# EAGLE design c64_csadapter-v1.0c (EAGLE 4.15)
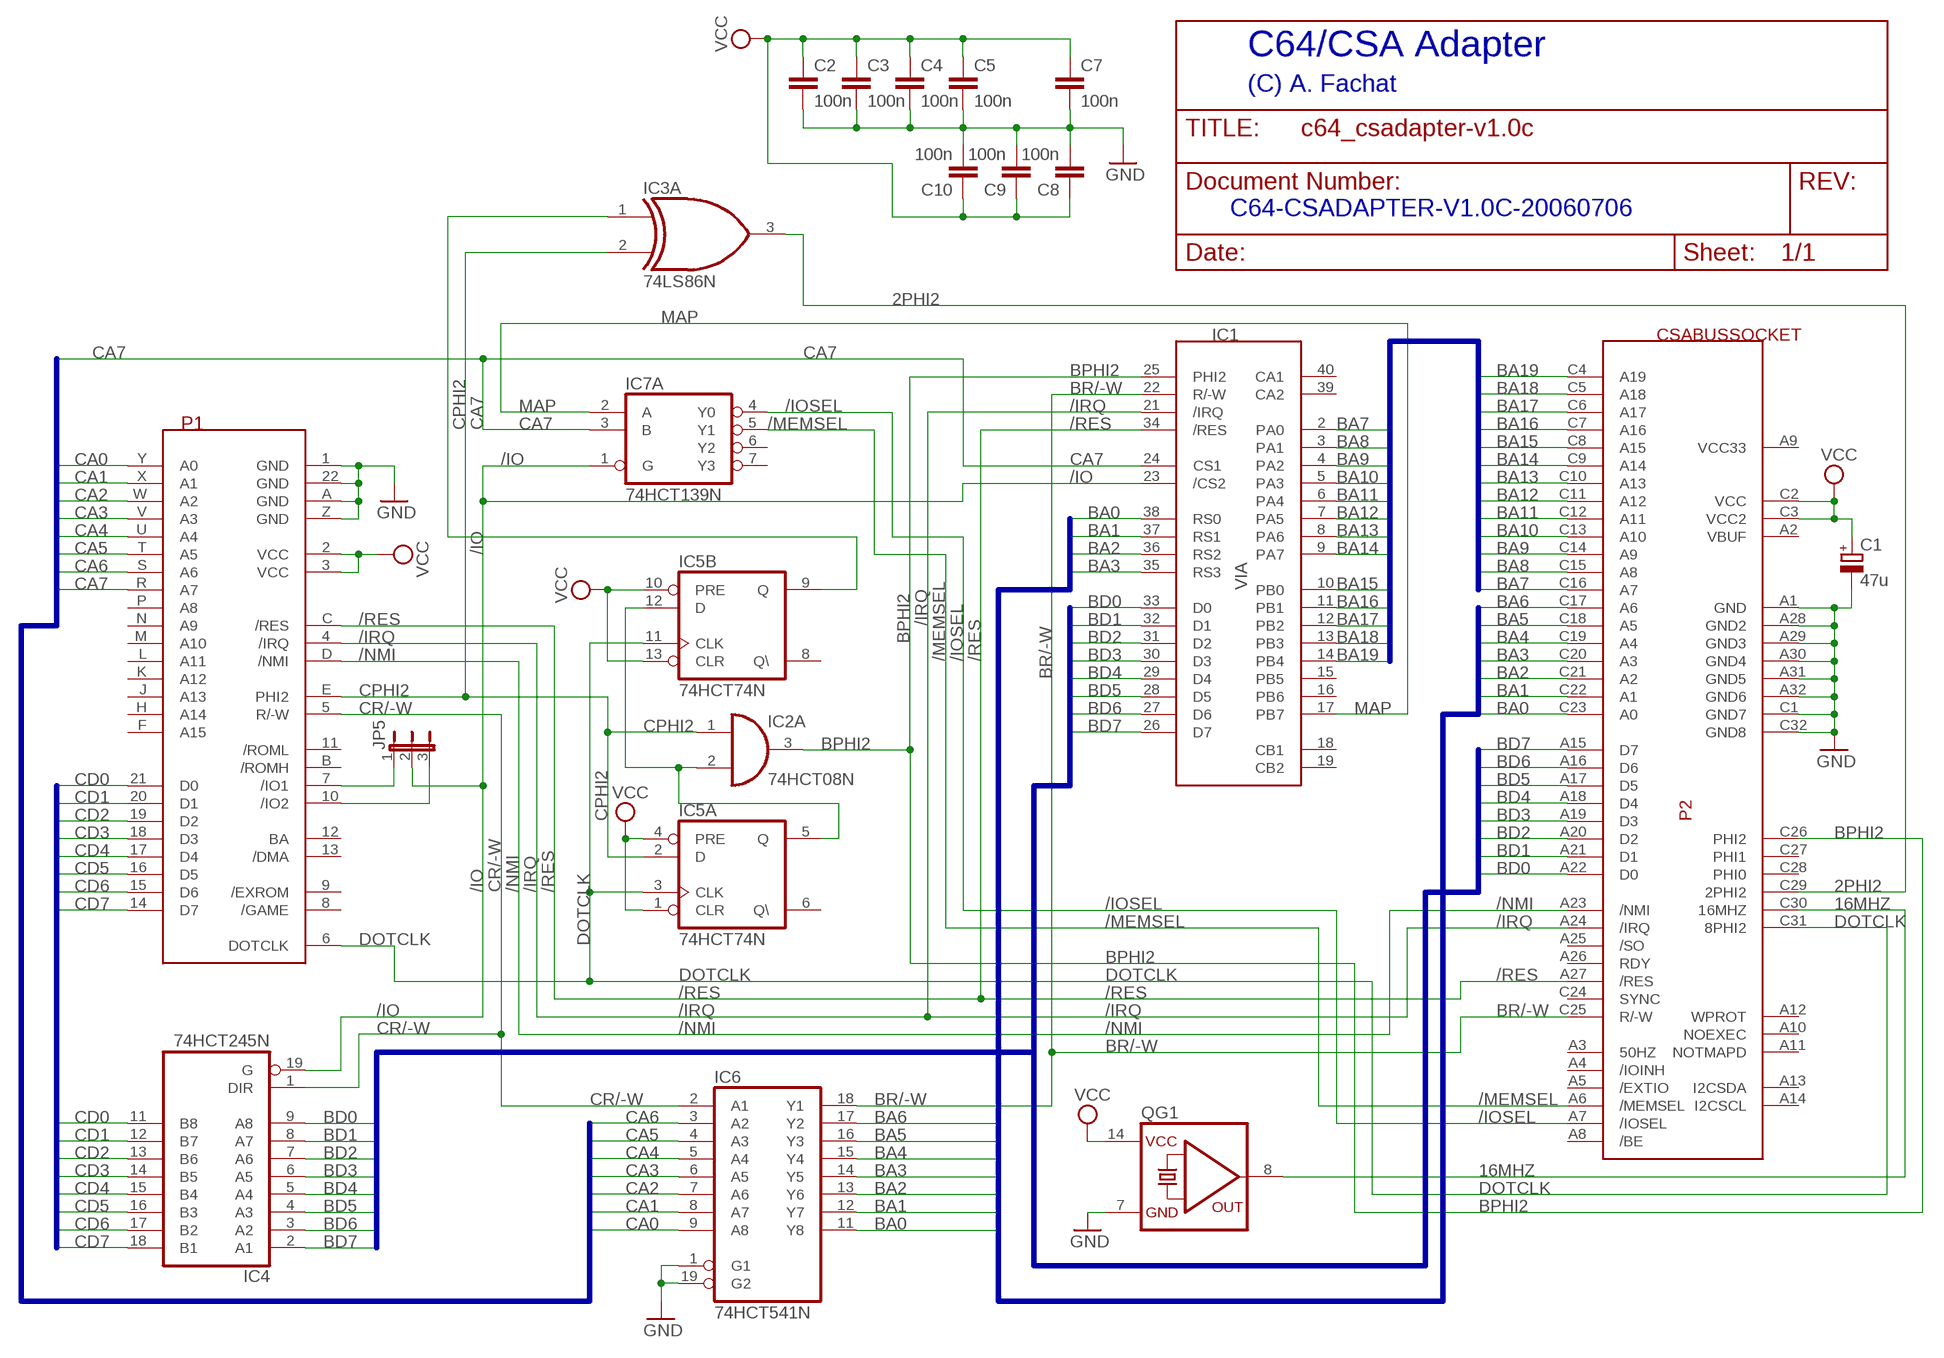
[diagram p0: schematic, sheet 1]

## Parts
C1  47u  CPOL-EUE2.5-5  [E2,5-5]
C2  100n  C-EU025-025X050  [C025-025X050]
C3  100n  C-EU025-025X050  [C025-025X050]
C4  100n  C-EU025-025X050  [C025-025X050]
C5  100n  C-EU025-025X050  [C025-025X050]
C7  100n  C-EU025-025X050  [C025-025X050]
C8  100n  C-EU025-025X050  [C025-025X050]
C9  100n  C-EU025-025X050  [C025-025X050]
C10  100n  C-EU025-025X050  [C025-025X050]
IC1  VIA  [DIL40]
IC2  74HCT08N  [DIL14]
IC3  74LS86N  [DIL14]
IC4  74HCT245N  [DIL20]
IC5  74HCT74N  [DIL14]
IC6  74HCT541N  [DIL20]
IC7  74HCT139N  [DIL16]
JP5  JP2E  [JP2]
P1  C64EXPANSION  [CARDCON-2.54-44]
P2  CSABUSSOCKET  [CSABUSSOCK]
QG1  QG5860  [DIL14S]

## Nets
2PHI2: IC3.3(A:O) P2.C29(2PHI2)
16MHZ: P2.C30(16MHZ) QG1.8(OUT)
/IO: IC1.23(/CS2) IC4.19(G) IC7.1(A:G) JP5.2
/IOSEL: IC7.4(A:Y0) P2.A7(/IOSEL)
/IRQ: IC1.21(/IRQ) P1.4(/IRQ) P2.A24(/IRQ)
/MEMSEL: IC7.5(A:Y1) P2.A6(/MEMSEL)
/NMI: P1.D(/NMI) P2.A23(/NMI)
/RES: IC1.34(/RES) P1.C(/RES) P2.A27(/RES)
BA0: IC1.38(RS0) IC6.11(Y8) P2.C23(A0)
BA1: IC1.37(RS1) IC6.12(Y7) P2.C22(A1)
BA2: IC1.36(RS2) IC6.13(Y6) P2.C21(A2)
BA3: IC1.35(RS3) IC6.14(Y5) P2.C20(A3)
BA4: IC6.15(Y4) P2.C19(A4)
BA5: IC6.16(Y3) P2.C18(A5)
BA6: IC6.17(Y2) P2.C17(A6)
BA7: IC1.2(PA0) P2.C16(A7)
BA8: IC1.3(PA1) P2.C15(A8)
BA9: IC1.4(PA2) P2.C14(A9)
BA10: IC1.5(PA3) P2.C13(A10)
BA11: IC1.6(PA4) P2.C12(A11)
BA12: IC1.7(PA5) P2.C11(A12)
BA13: IC1.8(PA6) P2.C10(A13)
BA14: IC1.9(PA7) P2.C9(A14)
BA15: IC1.10(PB0) P2.C8(A15)
BA16: IC1.11(PB1) P2.C7(A16)
BA17: IC1.12(PB2) P2.C6(A17)
BA18: IC1.13(PB3) P2.C5(A18)
BA19: IC1.14(PB4) P2.C4(A19)
BD0: IC1.33(D0) IC4.9(A8) P2.A22(D0)
BD1: IC1.32(D1) IC4.8(A7) P2.A21(D1)
BD2: IC1.31(D2) IC4.7(A6) P2.A20(D2)
BD3: IC1.30(D3) IC4.6(A5) P2.A19(D3)
BD4: IC1.29(D4) IC4.5(A4) P2.A18(D4)
BD5: IC1.28(D5) IC4.4(A3) P2.A17(D5)
BD6: IC1.27(D6) IC4.3(A2) P2.A16(D6)
BD7: IC1.26(D7) IC4.2(A1) P2.A15(D7)
BPHI2: IC1.25(PHI2) IC2.3(A:O) P2.C26(PHI2)
BR/-W: IC1.22(R/-W) IC6.18(Y1) P2.C25(R/-W)
CA0: IC6.9(A8) P1.Y(A0)
CA1: IC6.8(A7) P1.X(A1)
CA2: IC6.7(A6) P1.W(A2)
CA3: IC6.6(A5) P1.V(A3)
CA4: IC6.5(A4) P1.U(A4)
CA5: IC6.4(A3) P1.T(A5)
CA6: IC6.3(A2) P1.S(A6)
CA7: IC1.24(CS1) IC7.3(A:B) P1.R(A7)
CD0: IC4.11(B8) P1.21(D0)
CD1: IC4.12(B7) P1.20(D1)
CD2: IC4.13(B6) P1.19(D2)
CD3: IC4.14(B5) P1.18(D3)
CD4: IC4.15(B4) P1.17(D4)
CD5: IC4.16(B3) P1.16(D5)
CD6: IC4.17(B2) P1.15(D6)
CD7: IC4.18(B1) P1.14(D7)
CPHI2: IC2.1(A:I0) IC3.2(A:I1) IC5.2(A:D) P1.E(PHI2)
CR/-W: IC4.1(DIR) IC6.2(A1) P1.5(R/-W)
DOTCLK: IC5.3(A:CLK) IC5.11(B:CLK) P1.6(DOTCLK) P2.C31(8PHI2)
GND: C1.- C2.2 C3.2 C4.2 C5.2 C7.2 C8.2 C9.2 C10.2 IC6.1(G1) IC6.19(G2) P1.1(GND) P1.22(GND) P1.A(GND) P1.Z(GND) P2.A1(GND) P2.A28(GND2) P2.A29(GND3) P2.A30(GND4) P2.A31(GND5) P2.A32(GND6) P2.C1(GND7) P2.C32(GND8) QG1.7(GND)
MAP: IC1.17(PB7) IC7.2(A:A)
N$8: IC2.2(A:I1) IC5.5(A:Q) IC5.12(B:D)
N$11: JP5.1 P1.7(/IO1)
N$12: JP5.3 P1.10(/IO2)
N$17: IC3.1(A:I0) IC5.9(B:Q)
VCC: C1.+ C2.1 C3.1 C4.1 C5.1 C7.1 C8.1 C9.1 C10.1 IC5.1(A:CLR) IC5.4(A:PRE) IC5.10(B:PRE) IC5.13(B:CLR) P1.2(VCC) P1.3(VCC) P2.C2(VCC) P2.C3(VCC2) QG1.14(VCC)
Unconnected: IC1.15(PB5) IC1.16(PB6) IC1.18(CB1) IC1.19(CB2) IC1.39(CA2) IC1.40(CA1) IC2.4(B:I0) IC2.5(B:I1) IC2.6(B:O) IC2.8(C:O) IC2.9(C:I0) IC2.10(C:I1) IC2.11(D:O) IC2.12(D:I0) IC2.13(D:I1) IC3.4(B:I0) IC3.5(B:I1) IC3.6(B:O) IC3.8(C:O) IC3.9(C:I0) IC3.10(C:I1) IC3.11(D:O) IC3.12(D:I0) IC3.13(D:I1) IC5.6(A:Q\) IC5.8(B:Q\) IC7.6(A:Y2) IC7.7(A:Y3) IC7.9(B:Y3) IC7.10(B:Y2) IC7.11(B:Y1) IC7.12(B:Y0) IC7.13(B:B) IC7.14(B:A) IC7.15(B:G) P1.8(/GAME) P1.9(/EXROM) P1.11(/ROML) P1.12(BA) P1.13(/DMA) P1.B(/ROMH) P1.F(A15) P1.H(A14) P1.J(A13) P1.K(A12) P1.L(A11) P1.M(A10) P1.N(A9) P1.P(A8) P2.A2(VBUF) P2.A3(50HZ) P2.A4(/IOINH) P2.A5(/EXTIO) P2.A8(/BE) P2.A9(VCC33) P2.A10(NOEXEC) P2.A11(NOTMAPD) P2.A12(WPROT) P2.A13(I2CSDA) P2.A14(I2CSCL) P2.A25(/SO) P2.A26(RDY) P2.C24(SYNC) P2.C27(PHI1) P2.C28(PHI0)

## Buses
CD[0..7]
CA[0..7]
BA[0..6]
BD[0..7]
BA[7..19]

## Notes on the sheet
- C64/CSA Adapter
- (C) A. Fachat
- C64-CSADAPTER-V1.0C-20060706

## Power pins joined to a net without a drawn wire
GND: IC1.1(GND) IC2.7(P:GND) IC3.7(P:GND) IC4.10(GND) IC5.7(P:GND) IC6.10(GND) IC7.8(P:GND)
VCC: IC1.20(VCC) IC2.14(P:VCC) IC3.14(P:VCC) IC4.20(VCC) IC5.14(P:VCC) IC6.20(VCC) IC7.16(P:VCC)

## Library data of the parts
C1 = rcl:CPOL-EU: POLARIZED CAPACITOR, European symbol
C2-C5 C7-C10 = rcl:C-EU: CAPACITOR, European symbol
IC1 = csa:VIA
IC2 = 74xx-eu:74*08: Quad 2-input AND gate
IC3 = 74xx-us:74*86: Quad 2-input EXCLUSIV-OR (XOR) gate
IC4 = 74xx-eu:74*245: Octal BUS TRANSCEIVER, 3-state
IC5 = 74xx-eu:74*74: Dual D type positive edge triggered FLIP FLOP, preset and clear
IC6 = 74xx-eu:74*541: Octal BUFFER and LINE DRIVER, 3-state
IC7 = 74xx-eu:74*139: Dual 2-line to 4-line DECODER/DEMULTIPLEXER
JP5 = jumper:JP2E: JUMPER
P1 = csa:C64EXPANSION
P2 = csa:CSABUS
QG1 = crystal:QG5860: CRYSTAL RESONATOR

## Board
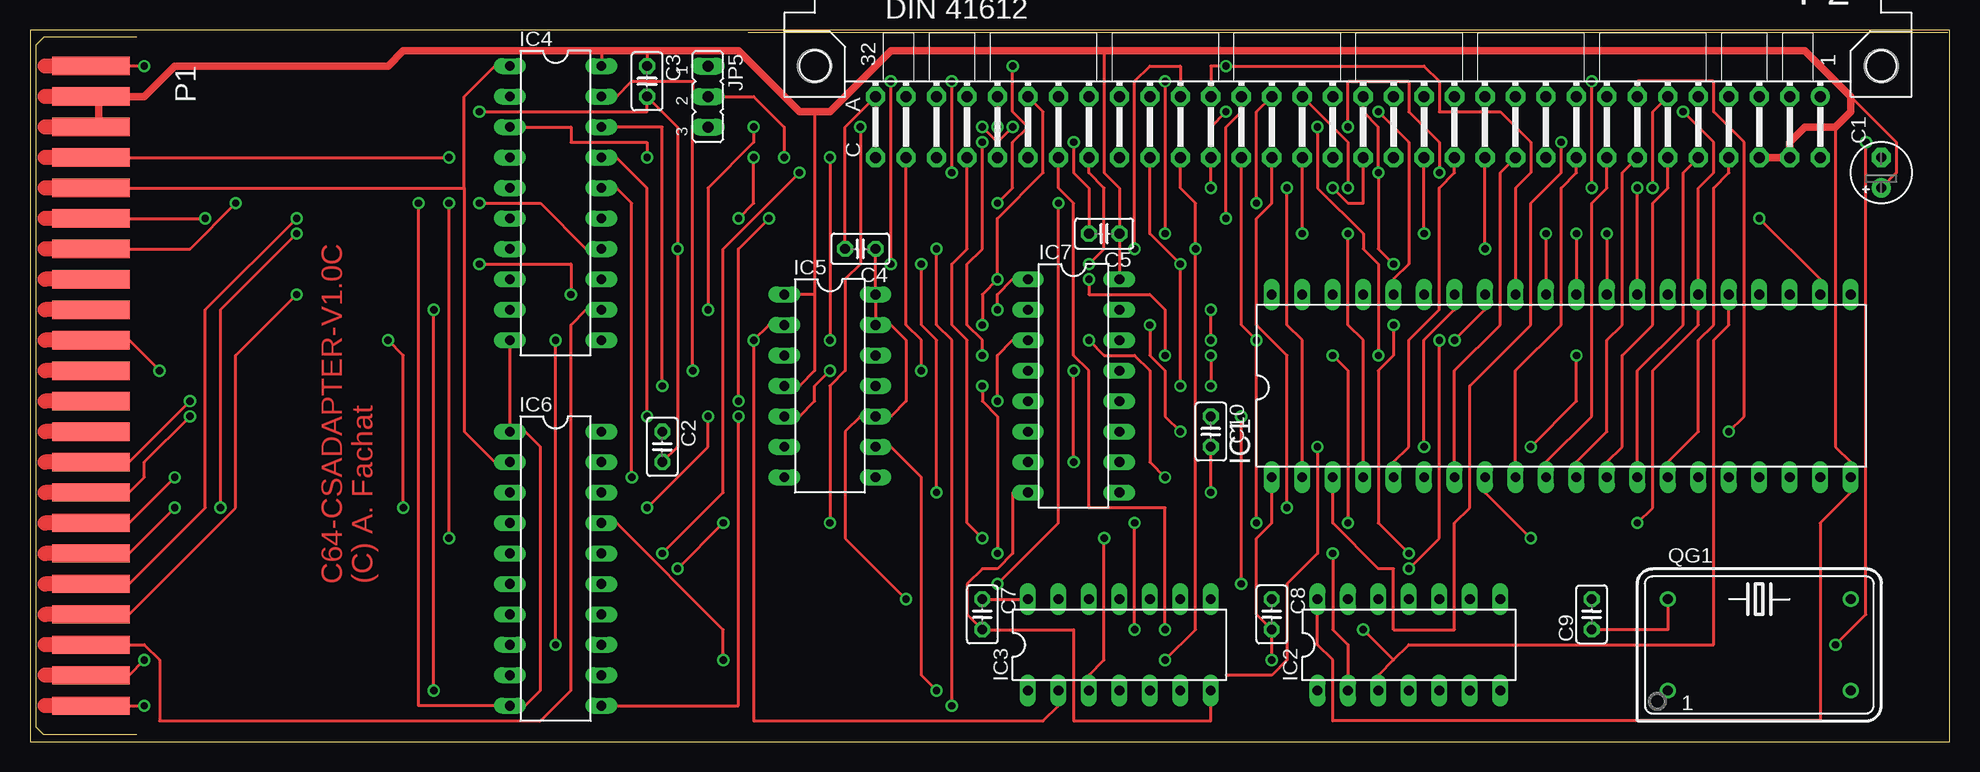
[diagram p1: board, top side]
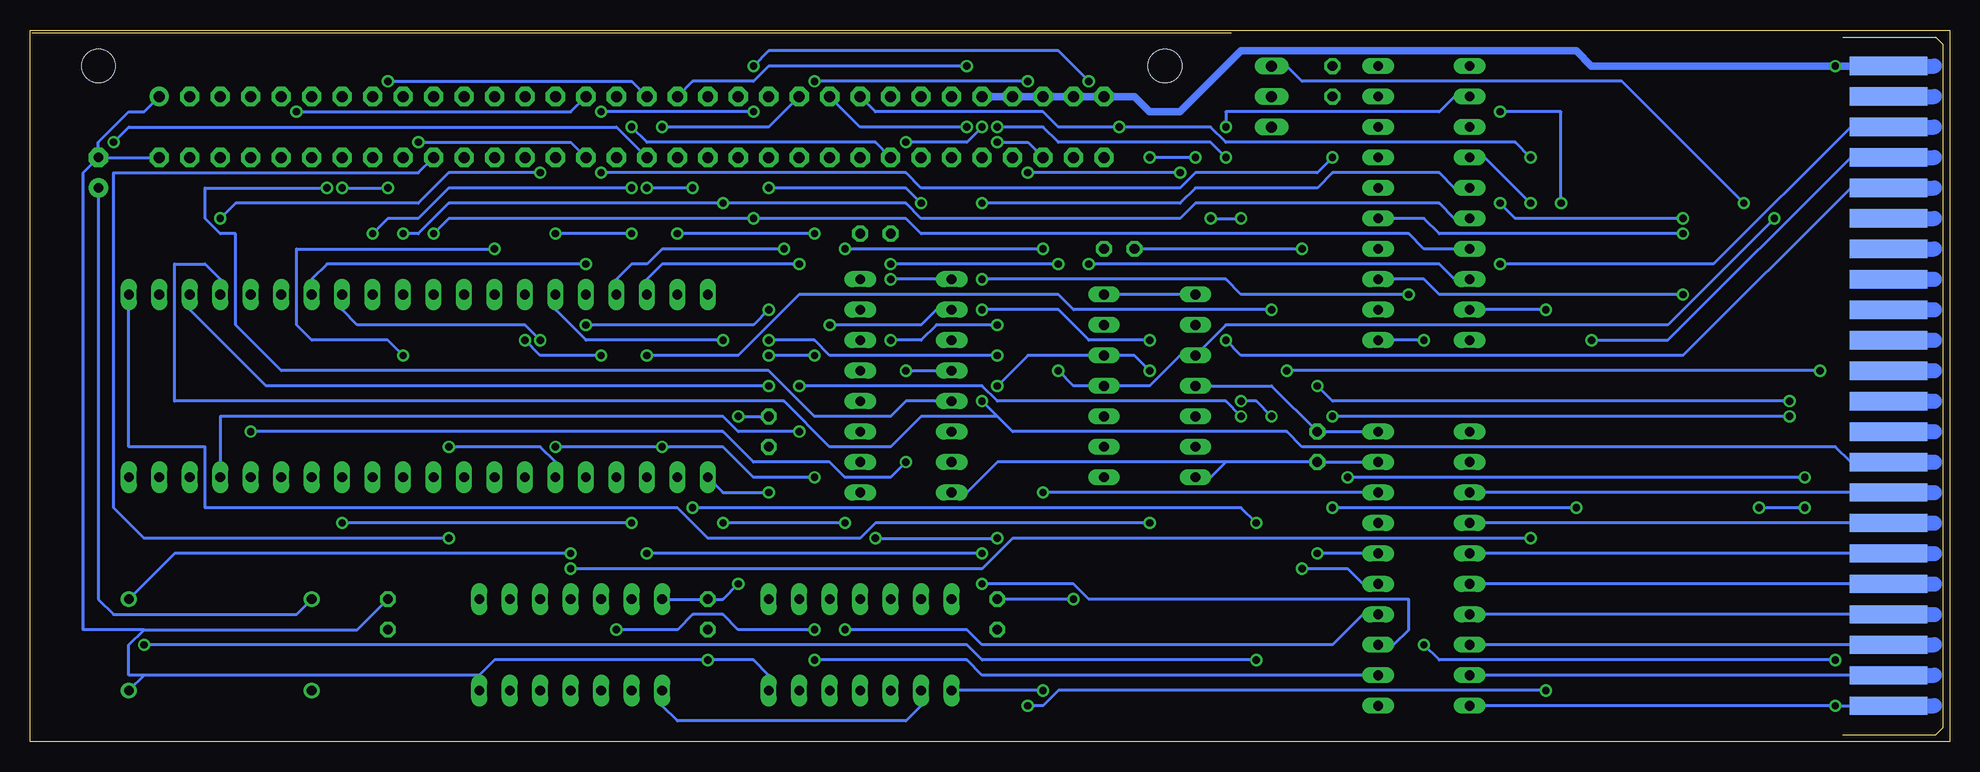
[diagram p2: board, bottom side, seen from below]

Size 160 x 59.36 mm. Coordinates in mm from the lower left corner, seen from the top.
Outline: 0,0 160,0 160,59.36 0,59.36 0,0
Copper layers (1*16): Top 0.035mm / dielectric 1.5mm / Bottom 0.035mm
Design rules "default": minimum track width 10mil, minimum drill 24mil, track to track 8mil, track to pad 8mil, pad to pad 8mil, via to via 8mil, smd to smd 8mil, copper to edge 40mil, drill to drill 8mil, minimum pad ring 10mil, minimum via ring 8mil, stop-mask expansion 4mil, vias tented up to drill 0mil, thermal gap 10mil

### Footprints (pad centres in the part's own frame; a part is rotated, then mirrored left to right if it is on the bottom)
E2,5-5 = drill 0.813 pad 1.6 round: + -1.27,0 | drill 0.813 pad 1.6 octagon: - 1.27,0
C025-025X050 = drill 0.813 octagon: 1 -1.27,0; 2 1.27,0
DIL40 = drill 0.813 long: 1 -16.51,-7.62; 2 -13.97,-7.62; 3 -11.43,-7.62; 4 -8.89,-7.62; 5 -6.35,-7.62; 6 -3.81,-7.62; 7 -1.27,-7.62; 8 1.27,-7.62; 9 3.81,-7.62; 10 6.35,-7.62; 11 8.89,-7.62; 12 11.43,-7.62; 13 13.97,-7.62; 14 16.51,-7.62; 15 19.05,-7.62; 16 21.59,-7.62; 17 24.13,-7.62; 18 26.67,-7.62; 19 29.21,-7.62; 20 31.75,-7.62; 21 31.75,7.62; 22 29.21,7.62; 23 26.67,7.62; 24 24.13,7.62; 25 21.59,7.62; 26 19.05,7.62; 27 16.51,7.62; 28 13.97,7.62; 29 11.43,7.62; 30 8.89,7.62; 31 6.35,7.62; 32 3.81,7.62; 33 1.27,7.62; 34 -1.27,7.62; 35 -3.81,7.62; 36 -6.35,7.62; 37 -8.89,7.62; 38 -11.43,7.62; 39 -13.97,7.62; 40 -16.51,7.62
DIL14 = drill 0.813 long: 1 -7.62,-3.81; 2 -5.08,-3.81; 3 -2.54,-3.81; 4 0,-3.81; 5 2.54,-3.81; 6 5.08,-3.81; 7 7.62,-3.81; 8 7.62,3.81; 9 5.08,3.81; 10 2.54,3.81; 11 0,3.81; 12 -2.54,3.81; 13 -5.08,3.81; 14 -7.62,3.81
DIL20 = drill 0.813 long: 1 -11.43,-3.81; 2 -8.89,-3.81; 3 -6.35,-3.81; 4 -3.81,-3.81; 5 -1.27,-3.81; 6 1.27,-3.81; 7 3.81,-3.81; 8 6.35,-3.81; 9 8.89,-3.81; 10 11.43,-3.81; 11 11.43,3.81; 12 8.89,3.81; 13 6.35,3.81; 14 3.81,3.81; 15 1.27,3.81; 16 -1.27,3.81; 17 -3.81,3.81; 18 -6.35,3.81; 19 -8.89,3.81; 20 -11.43,3.81
DIL16 = drill 0.813 long: 1 -8.89,-3.81; 2 -6.35,-3.81; 3 -3.81,-3.81; 4 -1.27,-3.81; 5 1.27,-3.81; 6 3.81,-3.81; 7 6.35,-3.81; 8 8.89,-3.81; 9 8.89,3.81; 10 6.35,3.81; 11 3.81,3.81; 12 1.27,3.81; 13 -1.27,3.81; 14 -3.81,3.81; 15 -6.35,3.81; 16 -8.89,3.81
JP2 = drill 0.914 long: 1 -2.54,0; 2 0,0; 3 2.54,0
CARDCON-2.54-44 = smd 1.524 x 6.477: 1 -29.21,5.715; 2 -26.67,5.715; 3 -24.13,5.715; 4 -21.59,5.715; 5 -19.05,5.715; 6 -16.51,5.715; 7 -13.97,5.715; 8 -11.43,5.715; 9 -8.89,5.715; 10 -6.35,5.715; 11 -3.81,5.715; 12 -1.27,5.715; 13 1.27,5.715; 14 3.81,5.715; 15 6.35,5.715; 16 8.89,5.715; 17 11.43,5.715; 18 13.97,5.715; 19 16.51,5.715; 20 19.05,5.715; 21 21.59,5.715; 22 24.13,5.715 | smd 1.524 x 6.477 bottom: A -29.21,5.715; B -26.67,5.715; C -24.13,5.715; D -21.59,5.715; E -19.05,5.715; F -16.51,5.715; H -13.97,5.715; J -11.43,5.715; K -8.89,5.715; L -6.35,5.715; M -3.81,5.715; N -1.27,5.715; P 1.27,5.715; R 3.81,5.715; S 6.35,5.715; T 8.89,5.715; U 11.43,5.715; V 13.97,5.715; W 16.51,5.715; X 19.05,5.715; Y 21.59,5.715; Z 24.13,5.715
CSABUSSOCK = drill 0.914 pad 1.6 round: A1 -7.62,-39.37 | drill 0.914 pad 1.6 octagon: A2 -7.62,-36.83; A3 -7.62,-34.29; A4 -7.62,-31.75; A5 -7.62,-29.21; A6 -7.62,-26.67; A7 -7.62,-24.13; A8 -7.62,-21.59; A9 -7.62,-19.05; A10 -7.62,-16.51; A11 -7.62,-13.97; A12 -7.62,-11.43; A13 -7.62,-8.89; A14 -7.62,-6.35; A15 -7.62,-3.81; A16 -7.62,-1.27; A17 -7.62,1.27; A18 -7.62,3.81; A19 -7.62,6.35; A20 -7.62,8.89; A21 -7.62,11.43; A22 -7.62,13.97; A23 -7.62,16.51; A24 -7.62,19.05; A25 -7.62,21.59; A26 -7.62,24.13; A27 -7.62,26.67; A28 -7.62,29.21; A29 -7.62,31.75; A30 -7.62,34.29; A31 -7.62,36.83; A32 -7.62,39.37; C1 -12.7,-39.37; C2 -12.7,-36.83; C3 -12.7,-34.29; C4 -12.7,-31.75; C5 -12.7,-29.21; C6 -12.7,-26.67; C7 -12.7,-24.13; C8 -12.7,-21.59; C9 -12.7,-19.05; C10 -12.7,-16.51; C11 -12.7,-13.97; C12 -12.7,-11.43; C13 -12.7,-8.89; C14 -12.7,-6.35; C15 -12.7,-3.81; C16 -12.7,-1.27; C17 -12.7,1.27; C18 -12.7,3.81; C19 -12.7,6.35; C20 -12.7,8.89; C21 -12.7,11.43; C22 -12.7,13.97; C23 -12.7,16.51; C24 -12.7,19.05; C25 -12.7,21.59; C26 -12.7,24.13; C27 -12.7,26.67; C28 -12.7,29.21; C29 -12.7,31.75; C30 -12.7,34.29; C31 -12.7,36.83; C32 -12.7,39.37 | hole 2.794: -5.08,44.45; -5.08,-44.45
DIL14S = drill 0.813 round: 1 -7.62,-3.81; 7 7.62,-3.81; 8 7.62,3.81; 14 -7.62,3.81

### Placement (x,y rotation side)
C1  154.3,47.46 90 top
C2  52.7,24.6 270 top
C3  51.43,55.08 270 top
C4  69.21,41.11 180 top
C5  89.53,42.38 180 top
C7  79.37,10.63 270 top
C8  103.5,10.63 270 top
C9  130.17,10.63 90 top
C10  98.42,25.87 270 top
IC1  120.01,29.68 0 top
IC2  114.93,8.09 0 top
IC3  90.8,8.09 0 top
IC4  43.81,44.92 270 top
IC5  66.67,29.68 270 top
IC6  43.81,14.44 270 top
IC7  86.99,29.68 270 top
JP5  56.51,53.81 270 top
P1  -0.64,27.14 270 top
P2  109.85,61.43 90 top
QG1  144.14,8.09 0 top

### Tracks (layer width: path | path; a pad name or v marks a point on that pad's centre or on a via)
2PHI2  (via drill 0.61)
  Top 0.254: v89.53,16.98 89.53,6.82 88.26,5.55 IC3.3 | v79.37,16.98 78.1,18.25 78.1,33.49 76.83,34.76 76.83,39.84 78.1,41.11 P2.C29
  Bottom 0.254: v89.53,16.98 v79.37,16.98
16MHZ  (via drill 0.61)
  Top 0.254: v114.93,15.71 112.39,18.25 112.39,30.95 113.66,32.22 v113.66,34.76 | v98.42,33.49 v98.42,36.03 | v79.37,32.22 79.37,33.49 78.1,34.76 78.1,39.84 79.37,41.11 v79.37,50
  Bottom 0.254: QG1.8 147.95,15.71 v114.93,15.71 | v113.66,34.76 99.69,34.76 v98.42,36.03 | v98.42,33.49 94.61,33.49 93.34,32.22 v79.37,32.22 | v79.37,50 76.83,50 P2.C30
/IO  (via drill 0.61)
  Top 0.254: IC4.19 48.89,53.81 50.16,55.08 55.24,55.08 55.24,53.81 JP5.2 60.32,53.81 62.86,51.27 v62.86,48.73 | v98.42,32.22 v98.42,29.68 | v94.61,32.22 94.61,36.03 93.34,37.3 88.26,37.3 v88.26,38.57 | v66.67,48.73 v66.67,33.49 | v80.64,36.03 80.64,37.3 81.91,38.57 IC7.1
  Bottom 0.254: v98.42,29.68 140.33,29.68 146.68,36.03 IC1.23 | v94.61,32.22 v98.42,32.22 | IC7.1 v88.26,38.57 | v62.86,48.73 v66.67,48.73 | v66.67,33.49 71.75,33.49 74.29,36.03 v80.64,36.03
/IOSEL  (via drill 0.61)
  Top 0.254: v86.99,23.33 v86.99,30.95 | v141.6,25.87 142.87,27.14 142.87,50 140.33,52.54 140.33,55.08 133.98,55.08 P2.A7
  Bottom 0.254: v86.99,23.33 88.26,22.06 92.07,22.06 93.34,23.33 99.69,23.33 102.23,25.87 v141.6,25.87 | v86.99,30.95 IC7.4
/IRQ  (via drill 0.61)
  Top 0.254: v66.67,18.25 66.67,29.68 67.94,30.95 67.94,38.57 69.21,39.84 v69.21,51.27 | P1.4 v34.92,48.73
  Bottom 0.254: v66.67,18.25 89.53,18.25 90.8,16.98 103.5,16.98 106.04,19.52 145.41,19.52 145.41,24.6 151.76,24.6 IC1.21 | P2.A24 89.53,52.54 75.56,52.54 74.29,51.27 v69.21,51.27 61.59,51.27 60.32,50 36.19,50 v34.92,48.73
/MEMSEL  (via drill 0.61)
  Top 0.254: v135.25,46.19 135.25,52.54 P2.A6
  Bottom 0.254: v135.25,46.19 145.41,46.19 145.41,43.65 144.14,42.38 142.87,42.38 142.87,34.76 139.06,30.95 98.42,30.95 94.61,27.14 88.26,27.14 86.99,28.41 IC7.5
/NMI  (via drill 0.61)
  Top 0.254: v81.91,51.27 80.64,50 v79.37,51.27 | v29.84,33.49 31.11,32.22 v31.11,19.52 | v51.43,19.52 56.51,24.6 v56.51,27.14 | v59.05,28.41 59.05,41.11 v61.59,43.65 | v59.05,43.65 60.32,44.92 v60.32,48.73
  Bottom 0.254: P2.A23 90.8,51.27 v81.91,51.27 | v79.37,51.27 75.56,51.27 74.29,50 61.59,50 v60.32,48.73 | v29.84,33.49 23.49,33.49 8.25,48.73 P1.D | v31.11,19.52 v51.43,19.52 | v56.51,27.14 57.78,28.41 v59.05,28.41 | v61.59,43.65 v59.05,43.65
/RES  (via drill 0.61)
  Top 0.254: 99.69,5.55 103.5,5.55 104.77,6.82 104.77,13.17 107.31,15.71 v107.31,24.6 | P2.A27 84.45,52.54 84.45,47.46 80.64,43.65 v80.64,38.57 79.37,37.3 v79.37,34.76 | v37.46,39.84 45.08,39.84 v45.08,37.3 | IC1.34 118.74,36.03 116.2,33.49 v116.2,24.6 | v94.61,22.06 93.34,23.33 93.34,30.95 92.07,32.22 89.53,32.22 v88.26,33.49
  Bottom 0.254: v37.46,39.84 19.68,39.84 8.25,51.27 P1.C | v45.08,37.3 59.05,37.3 60.32,38.57 v80.64,38.57 | v79.37,34.76 84.45,34.76 85.72,33.49 v88.26,33.49 | v116.2,24.6 v107.31,24.6 102.23,24.6 99.69,22.06 v94.61,22.06
BA0  (via drill 0.61)
  Top 0.254: v59.05,27.14 59.05,3.01 IC6.11 | v95.88,29.68 v95.88,39.84 93.34,42.38 P2.C23
  Bottom 0.254: v59.05,27.14 60.32,28.41 79.37,28.41 80.64,29.68 v95.88,29.68 | v95.88,39.84 107.31,39.84 108.58,38.57 IC1.38
BA1  (via drill 0.61)
  Top 0.254: v94.61,6.82 97.15,9.36 v97.15,41.11 97.15,44.92 95.88,46.19 P2.C22
  Bottom 0.254: v94.61,6.82 81.91,6.82 80.64,5.55 IC6.12 | v97.15,41.11 107.31,41.11 108.58,39.84 109.85,39.84 111.12,38.57 IC1.37
BA2  (via drill 0.61)
  Top 0.254: v80.64,13.17 85.72,18.25 v85.72,44.92 | v98.42,46.19 P2.C21 98.42,51.27 v99.69,52.54 | v112.39,52.54 114.93,50 114.93,39.84 113.66,38.57 IC1.36
  Bottom 0.254: v80.64,13.17 73.02,13.17 71.75,11.9 45.08,11.9 45.08,9.36 46.35,8.09 IC6.13 | v85.72,44.92 86.99,46.19 v98.42,46.19 | v99.69,52.54 v112.39,52.54
BA3  (via drill 0.61)
  Top 0.254: v92.07,9.36 v92.07,18.25 | v102.23,18.25 v102.23,33.49 100.96,34.76 P2.C20
  Bottom 0.254: v92.07,9.36 81.91,9.36 80.64,8.09 51.43,8.09 48.89,10.63 IC6.14 | v92.07,18.25 v102.23,18.25 | v102.23,33.49 113.66,33.49 116.2,36.03 IC1.35
BA4  (via drill 0.61)
  Top 0.254: v53.97,14.44 v57.78,18.25 | v104.77,19.52 104.77,32.22 102.23,34.76 102.23,43.65 103.5,44.92 P2.C19
  Bottom 0.254: v53.97,14.44 50.16,14.44 48.89,13.17 IC6.15 | v57.78,18.25 59.05,19.52 v104.77,19.52
BA5  (via drill 0.61)
  Top 0.254: v52.7,15.71 57.78,20.79 57.78,41.11 v64.13,47.46 | v76.83,47.46 v76.83,55.08 | v94.61,55.08 v94.61,42.38 | v106.04,42.38 P2.C18
  Bottom 0.254: v64.13,47.46 v76.83,47.46 | v76.83,55.08 v94.61,55.08 | v94.61,42.38 v106.04,42.38 | IC6.16 v52.7,15.71
BA6  (via drill 0.61)
  Top 0.254: v57.78,6.82 57.78,9.36 48.89,18.25 IC6.17 | v150.49,8.09 153.03,10.63 v153.03,50
  Bottom 0.254: v57.78,6.82 80.64,6.82 81.91,8.09 v150.49,8.09 | v153.03,50 151.76,51.27 111.12,51.27 P2.C17
BA7  (via drill 0.61)
  Top 0.254: v104.77,46.19 104.77,34.76 106.04,33.49 IC1.2 | v108.58,46.19 109.85,44.92 111.12,44.92 P2.C16
  Bottom 0.254: v104.77,46.19 v108.58,46.19
BA8  (via drill 0.61)
  Top 0.254: v127.63,50 127.63,47.46 125.09,44.92 125.09,34.76 120.01,29.68 120.01,19.52 118.74,18.25 118.74,9.36 113.66,9.36 113.66,14.44 112.39,14.44 108.58,18.25 IC1.3
  Bottom 0.254: v127.63,50 114.93,50 P2.C15
BA9  (via drill 0.61)
  Top 0.254: v109.85,42.38 109.85,34.76 111.12,33.49 IC1.4 | v116.2,42.38 P2.C14
  Bottom 0.254: v109.85,42.38 v116.2,42.38
BA10
  Top 0.254: P2.C13 118.74,47.46 117.47,46.19 117.47,36.03 114.93,33.49 114.93,24.6 113.66,23.33 IC1.5
BA11  (via drill 0.61)
  Top 0.254: v125.09,24.6 128.9,28.41 v128.9,32.22 | v121.28,41.11 P2.C12
  Bottom 0.254: v125.09,24.6 117.47,24.6 116.2,23.33 IC1.6 | v128.9,32.22 130.17,33.49 136.52,33.49 137.79,34.76 137.79,41.11 v121.28,41.11
BA12
  Top 0.254: P2.C11 122.55,47.46 122.55,34.76 118.74,30.95 IC1.7
BA13  (via drill 0.61)
  Top 0.254: v125.09,16.98 121.28,20.79 IC1.8
  Bottom 0.254: v125.09,16.98 150.49,16.98 153.03,19.52 153.03,47.46 127.63,47.46 P2.C10
BA14
  Top 0.254: P2.C9 128.9,47.46 127.63,46.19 127.63,34.76 123.82,30.95 IC1.9
BA15
  Top 0.254: P2.C8 131.44,46.19 130.17,44.92 130.17,27.14 126.36,23.33 IC1.10
BA16
  Top 0.254: P2.C7 132.71,47.46 132.71,34.76 131.44,33.49 131.44,25.87 128.9,23.33 IC1.11
BA17
  Top 0.254: P2.C6 136.52,46.19 135.25,44.92 135.25,34.76 132.71,32.22 132.71,24.6 131.44,23.33 IC1.12
BA18
  Top 0.254: P2.C5 137.79,47.46 137.79,34.76 133.98,30.95 IC1.13
BA19
  Top 0.254: P2.C4 141.6,47.46 140.33,46.19 140.33,34.76 139.06,33.49 139.06,25.87 136.52,23.33 IC1.14
BD0  (via drill 0.61)
  Top 0.254: v33.65,4.28 v33.65,36.03 | v76.83,3.01 76.83,33.49 75.56,34.76 v75.56,41.11 | v92.07,41.11 92.07,55.08 93.34,56.35 95.88,56.35 P2.A22 | v118.74,33.49 121.28,36.03 IC1.33 | v112.39,32.22 112.39,39.84 111.12,41.11 111.12,42.38 107.31,46.19 v107.31,51.27
  Bottom 0.254: v33.65,4.28 74.29,4.28 75.56,3.01 v76.83,3.01 | v75.56,41.11 v92.07,41.11 | v33.65,36.03 IC4.9 | v118.74,33.49 117.47,32.22 v112.39,32.22 | v107.31,51.27 98.42,51.27 P2.A22
BD1  (via drill 0.61)
  Top 0.254: P2.A21 98.42,56.35 v99.69,56.35 116.2,56.35 117.47,55.08 117.47,52.54 122.55,52.54 125.09,50 125.09,47.46 123.82,46.19 IC1.32 | v71.75,39.84 v71.75,55.08
  Bottom 0.254: v71.75,39.84 42.54,39.84 41.27,38.57 IC4.8 | v71.75,55.08 74.29,57.62 98.42,57.62 v99.69,56.35
BD2  (via drill 0.61)
  Top 0.254: v99.69,43.65 99.69,51.27 100.96,52.54 P2.A20 | v126.36,42.38 IC1.31
  Bottom 0.254: IC4.7 43.81,41.11 45.08,42.38 85.72,42.38 86.99,43.65 v99.69,43.65 125.09,43.65 v126.36,42.38
BD3  (via drill 0.61)
  Top 0.254: v102.23,44.92 102.23,52.54 P2.A19 | v128.9,42.38 IC1.30
  Bottom 0.254: IC4.6 41.27,43.65 42.54,44.92 62.86,44.92 64.13,43.65 85.72,43.65 86.99,44.92 v102.23,44.92 125.09,44.92 127.63,42.38 v128.9,42.38
BD4  (via drill 0.61)
  Top 0.254: v109.85,46.19 109.85,50 P2.A18 | v131.44,42.38 IC1.29 | v80.64,44.92 81.91,46.19 81.91,50 83.18,51.27 81.91,52.54 v81.91,56.35
  Bottom 0.254: v131.44,42.38 130.17,43.65 127.63,43.65 125.09,46.19 v109.85,46.19 | v80.64,44.92 64.13,44.92 62.86,46.19 52.7,46.19 51.43,47.46 42.54,47.46 41.27,46.19 IC4.5 | v81.91,56.35 98.42,56.35 99.69,55.08 104.77,55.08 P2.A18
BD5  (via drill 0.61)
  Top 0.254: v34.92,16.98 v34.92,44.92 | v114.93,14.44 117.47,16.98 v117.47,33.49 | v130.17,46.19 v130.17,55.08 | IC1.28 v133.98,46.19
  Bottom 0.254: v34.92,44.92 38.73,48.73 IC4.4 | v34.92,16.98 78.1,16.98 80.64,14.44 v114.93,14.44 | v117.47,33.49 118.74,34.76 132.71,34.76 133.98,36.03 IC1.28 | P2.A17 109.85,55.08 v130.17,55.08 | v133.98,46.19 v130.17,46.19
BD6  (via drill 0.61)
  Top 0.254: v113.66,39.84 112.39,41.11 v112.39,47.46 112.39,51.27 111.12,52.54 P2.A16 | v51.43,48.73 51.43,50 45.08,50 45.08,51.27 IC4.3
  Bottom 0.254: v113.66,39.84 135.25,39.84 136.52,38.57 IC1.27 | v51.43,48.73 52.7,47.46 62.86,47.46 64.13,46.19 85.72,46.19 86.99,47.46 v112.39,47.46
BD7  (via drill 0.61)
  Top 0.254: v137.79,52.54 140.33,50 140.33,47.46 139.06,46.19 IC1.26 139.06,34.76 135.25,30.95 135.25,19.52 v133.98,18.25 | v108.58,32.22 109.85,30.95 v109.85,18.25 | v56.51,36.03 56.51,46.19 60.32,50 v60.32,51.27
  Bottom 0.254: v137.79,52.54 114.93,52.54 P2.A15 | v108.58,32.22 100.96,32.22 95.88,37.3 74.29,37.3 73.02,36.03 v56.51,36.03 | v109.85,18.25 v133.98,18.25 | IC4.2 41.27,53.81 42.54,52.54 60.32,52.54 v60.32,51.27
BPHI2  (via drill 0.61)
  Top 0.254: 113.66,6.82 114.93,8.09 140.33,8.09 140.33,33.49 141.6,34.76 IC1.25 | 113.66,6.82 112.39,5.55 IC2.3 | P2.C26 85.72,46.19 86.99,44.92 86.99,32.22 88.26,30.95 88.26,19.52 94.61,19.52 v94.61,9.36 | v111.12,9.36 113.66,6.82
  Bottom 0.254: v94.61,9.36 100.96,9.36 102.23,10.63 104.77,10.63 106.04,9.36 v111.12,9.36
BR/-W  (via drill 0.61)
  Top 0.254: v75.56,20.79 75.56,33.49 74.29,34.76 v74.29,39.84 | v88.26,39.84 89.53,41.11 89.53,46.19 88.26,47.46 P2.C25 | v144.14,43.65 149.22,38.57 IC1.22 | v117.47,47.46 117.47,50 114.93,52.54 114.93,55.08 109.85,55.08 v109.85,51.27
  Bottom 0.254: v74.29,39.84 v88.26,39.84 | IC6.18 v75.56,20.79 | v144.14,43.65 142.87,44.92 127.63,44.92 125.09,47.46 v117.47,47.46 | v109.85,51.27 108.58,50 89.53,50 P2.C25
CA0
  Bottom 0.254: P1.Y IC6.9
CA1
  Bottom 0.254: P1.X IC6.8
CA2
  Bottom 0.254: P1.W IC6.7
CA3
  Bottom 0.254: P1.V IC6.6
CA4
  Bottom 0.254: P1.U IC6.5
CA5
  Bottom 0.254: P1.T IC6.4
CA6
  Bottom 0.254: P1.S IC6.3
CA7  (via drill 0.61)
  Top 0.254: v80.64,28.41 80.64,32.22 81.91,33.49 IC7.3
  Bottom 0.254: 79.37,27.14 78.1,25.87 55.24,25.87 53.97,24.6 9.52,24.6 8.25,23.33 P1.R | 79.37,27.14 v80.64,28.41 | 79.37,27.14 85.72,27.14 88.26,24.6 93.34,24.6 97.15,28.41 147.95,28.41 147.95,39.84 145.41,39.84 144.14,38.57 IC1.24
CD0  (via drill 0.61)
  Top 0.254: v43.81,8.09 v43.81,33.49 | v9.52,6.82 8.25,5.55 P1.21
  Bottom 0.254: v43.81,8.09 42.54,6.82 v9.52,6.82 | v43.81,33.49 IC4.11
CD1
  Top 0.254: IC4.12 46.35,36.03 45.08,34.76 45.08,4.28 42.54,1.74 10.79,1.74 10.79,6.82 9.52,8.09 P1.20
CD2  (via drill 0.61)
  Top 0.254: v22.22,37.3 17.14,32.22 17.14,19.52 8.25,10.63 P1.19
  Bottom 0.254: v22.22,37.3 42.54,37.3 43.81,38.57 IC4.13
CD3  (via drill 0.61)
  Top 0.254: v37.46,44.92 42.54,44.92 46.35,41.11 IC4.14 | v22.22,43.65 14.6,36.03 14.6,19.52 8.25,13.17 P1.18
  Bottom 0.254: v37.46,44.92 36.19,43.65 v22.22,43.65
CD4  (via drill 0.61)
  Top 0.254: v22.22,42.38 15.87,36.03 v15.87,19.52 | v12.06,19.52 8.25,15.71 P1.17
  Bottom 0.254: v22.22,42.38 42.54,42.38 43.81,43.65 IC4.15 | v12.06,19.52 v15.87,19.52
CD5  (via drill 0.61)
  Top 0.254: v50.16,22.06 50.16,44.92 48.89,46.19 IC4.16 | v12.06,22.06 8.25,18.25 P1.16
  Bottom 0.254: v12.06,22.06 v50.16,22.06
CD6  (via drill 0.61)
  Top 0.254: v51.43,27.14 51.43,46.19 48.89,48.73 IC4.17 | v13.33,27.14 9.52,23.33 9.52,22.06 8.25,20.79 P1.15
  Bottom 0.254: v13.33,27.14 v51.43,27.14
CD7  (via drill 0.61)
  Top 0.254: v52.7,29.68 52.7,51.27 IC4.18 | v13.33,28.41 8.25,23.33 P1.14
  Bottom 0.254: v52.7,29.68 51.43,28.41 v13.33,28.41
CPHI2  (via drill 0.61)
  Top 0.254: IC3.2 85.72,3.01 84.45,1.74 60.32,1.74 v60.32,33.49 61.59,34.76 IC5.2
  Bottom 0.254: IC3.2 85.72,3.01 86.99,1.74 106.04,1.74 107.31,3.01 IC2.1 | v60.32,33.49 59.05,32.22 22.22,32.22 8.25,46.19 P1.E
CR/-W
  Top 0.254: 36.19,46.19 36.19,53.81 38.73,56.35 IC4.1 | 36.19,46.19 36.19,25.87 38.73,23.33 IC6.2 | P1.5 36.19,46.19
DOTCLK  (via drill 0.61)
  Top 0.254: P2.C31 73.02,34.76 74.29,33.49 v74.29,30.95 | P1.6 v14.6,43.65
  Bottom 0.254: v74.29,30.95 73.02,29.68 IC5.11 66.67,29.68 64.13,32.22 IC5.3 60.32,34.76 23.49,34.76 v14.6,43.65
GND  (via drill 0.61)
  Top 0.254: IC1.1 103.5,18.25 102.23,16.98 102.23,10.63 C8.2 v103.5,6.82 | v98.42,20.79 C10.2 | IC3.7 98.42,1.74 86.99,1.74 86.99,9.36 C7.2 78.1,10.63 78.1,13.17 79.37,14.44 80.64,14.44 81.91,15.71 81.91,20.79 IC7.8 | IC4.10 IC6.1 41.27,25.87 42.54,24.6 42.54,4.28 41.27,3.01 IC6.10 32.38,3.01 v32.38,44.92 | P1.22 v9.52,3.01 | C4.2 67.94,51.27 P2.A32 P2.C32 | C5.2 88.26,46.19 86.99,47.46 v86.99,50 | P2.A28 v80.64,51.27 | C2.2 53.97,24.6 v53.97,41.11 53.97,51.27 C3.2 51.43,52.54 v37.46,52.54 | v9.52,56.35 P1.A
  Bottom 0.254: IC1.1 102.23,20.79 v98.42,20.79 | C1.- P2.C1 | P2.A1 150.49,52.54 151.76,52.54 154.3,50 C1.- | 122.55,5.55 121.28,6.82 v103.5,6.82 99.69,6.82 98.42,5.55 IC3.7 | 150.49,5.55 QG1.7 | 122.55,5.55 150.49,5.55 | 122.55,5.55 IC2.7 | C9.2 132.71,9.36 150.49,9.36 | 150.49,9.36 151.76,8.09 151.76,5.55 150.49,5.55 | C1.- 155.57,47.46 155.57,9.36 150.49,9.36 | IC6.10 v9.52,3.01 P1.22 | v86.99,50 81.91,50 v80.64,51.27 | IC6.19 C2.2 60.32,23.33 | 60.32,23.33 61.59,22.06 IC5.7 | 60.32,23.33 79.37,23.33 81.91,20.79 IC7.8 | v37.46,52.54 32.38,52.54 v32.38,44.92 | 4.44,56.35 P1.A 5.71,56.35 | v53.97,41.11 C4.2
  Bottom 0.61: P2.A28 P2.A29 P2.A30 P2.A31 P2.A32 67.94,53.81 66.67,52.54 64.13,52.54 59.05,57.62 31.11,57.62 29.84,56.35 v9.52,56.35 5.71,56.35
MAP  (via drill 0.61)
  Top 0.254: v95.88,25.87 94.61,27.14 94.61,30.95 93.34,32.22 v93.34,34.76
  Bottom 0.254: v95.88,25.87 100.96,25.87 102.23,27.14 144.14,27.14 IC1.17 | v93.34,34.76 85.72,34.76 84.45,36.03 IC7.2
N$8  (via drill 0.61)
  Top 0.254: v66.67,30.95 65.4,29.68 65.4,28.41 64.13,27.14 IC5.5 | v108.58,15.71 108.58,9.36 109.85,8.09 IC2.2 | v80.64,15.71 80.64,27.14 79.37,28.41 v79.37,29.68
  Bottom 0.254: v66.67,30.95 67.94,32.22 IC5.12 76.83,32.22 v79.37,29.68 | v80.64,15.71 v108.58,15.71
N$11  (via drill 0.61)
  Top 0.254: v17.14,44.92 13.33,41.11 P1.7
  Bottom 0.254: v17.14,44.92 27.3,55.08 53.97,55.08 55.24,56.35 JP5.1
N$12  (via drill 0.61)
  Top 0.254: v55.24,30.95 55.24,51.27 JP5.3 | v10.79,30.95 8.25,33.49 P1.10
  Bottom 0.254: v10.79,30.95 v55.24,30.95
N$17  (via drill 0.61)
  Top 0.254: v75.56,4.28 74.29,5.55 74.29,22.06 71.75,24.6 IC5.9
  Bottom 0.254: v75.56,4.28 IC3.1
VCC  (via drill 0.61)
  Top 0.254: C7.1 IC3.14 | C4.1 IC5.14 IC5.13 71.75,34.76 73.02,33.49 73.02,28.41 71.75,27.14 IC5.10 69.21,27.14 67.94,25.87 67.94,16.98 v73.02,11.9 | v100.96,13.17 v100.96,27.14 | C9.1 136.52,9.36 QG1.14 | IC7.16 C5.1 90.8,46.19 89.53,47.46 89.53,57.62 | 47.62,57.62 IC4.20 | 51.43,57.62 C3.1 | 150.49,51.27 150.49,24.6 151.76,23.33 IC1.20 151.76,20.79 149.22,18.25 149.22,1.74 108.58,1.74 108.58,6.82 107.31,8.09 IC2.14 | 65.4,52.54 65.4,37.3 | 65.4,37.3 65.4,30.95 64.13,29.68 IC5.4 | 65.4,37.3 IC5.1 | C1.+ 155.57,47.46 155.57,50 151.76,53.81 | P1.3 5.71,51.27 | 5.71,53.81 P1.2
  Top 0.61: P2.C3 P2.C2 146.68,50 147.95,51.27 150.49,51.27 151.76,52.54 151.76,53.81 147.95,57.62 89.53,57.62 71.75,57.62 66.67,52.54 65.4,52.54 64.13,52.54 59.05,57.62 51.43,57.62 47.62,57.62 31.11,57.62 29.84,56.35 12.06,56.35 9.52,53.81 5.71,53.81 5.71,51.27
  Bottom 0.254: v73.02,11.9 C7.1 | IC2.14 C8.1 102.23,11.9 v100.96,13.17 | v100.96,27.14 C10.1 | IC6.20 C2.1 56.51,29.68 IC5.4 | QG1.14 137.79,10.63 153.03,10.63 154.3,11.9 C1.+ | IC5.1 IC5.14

### Text on the board
Top: C64-CSADAPTER-V1.0C | (C) A. Fachat